# EAGLE schematic wrover-cam1 (EAGLE 9.6.2)
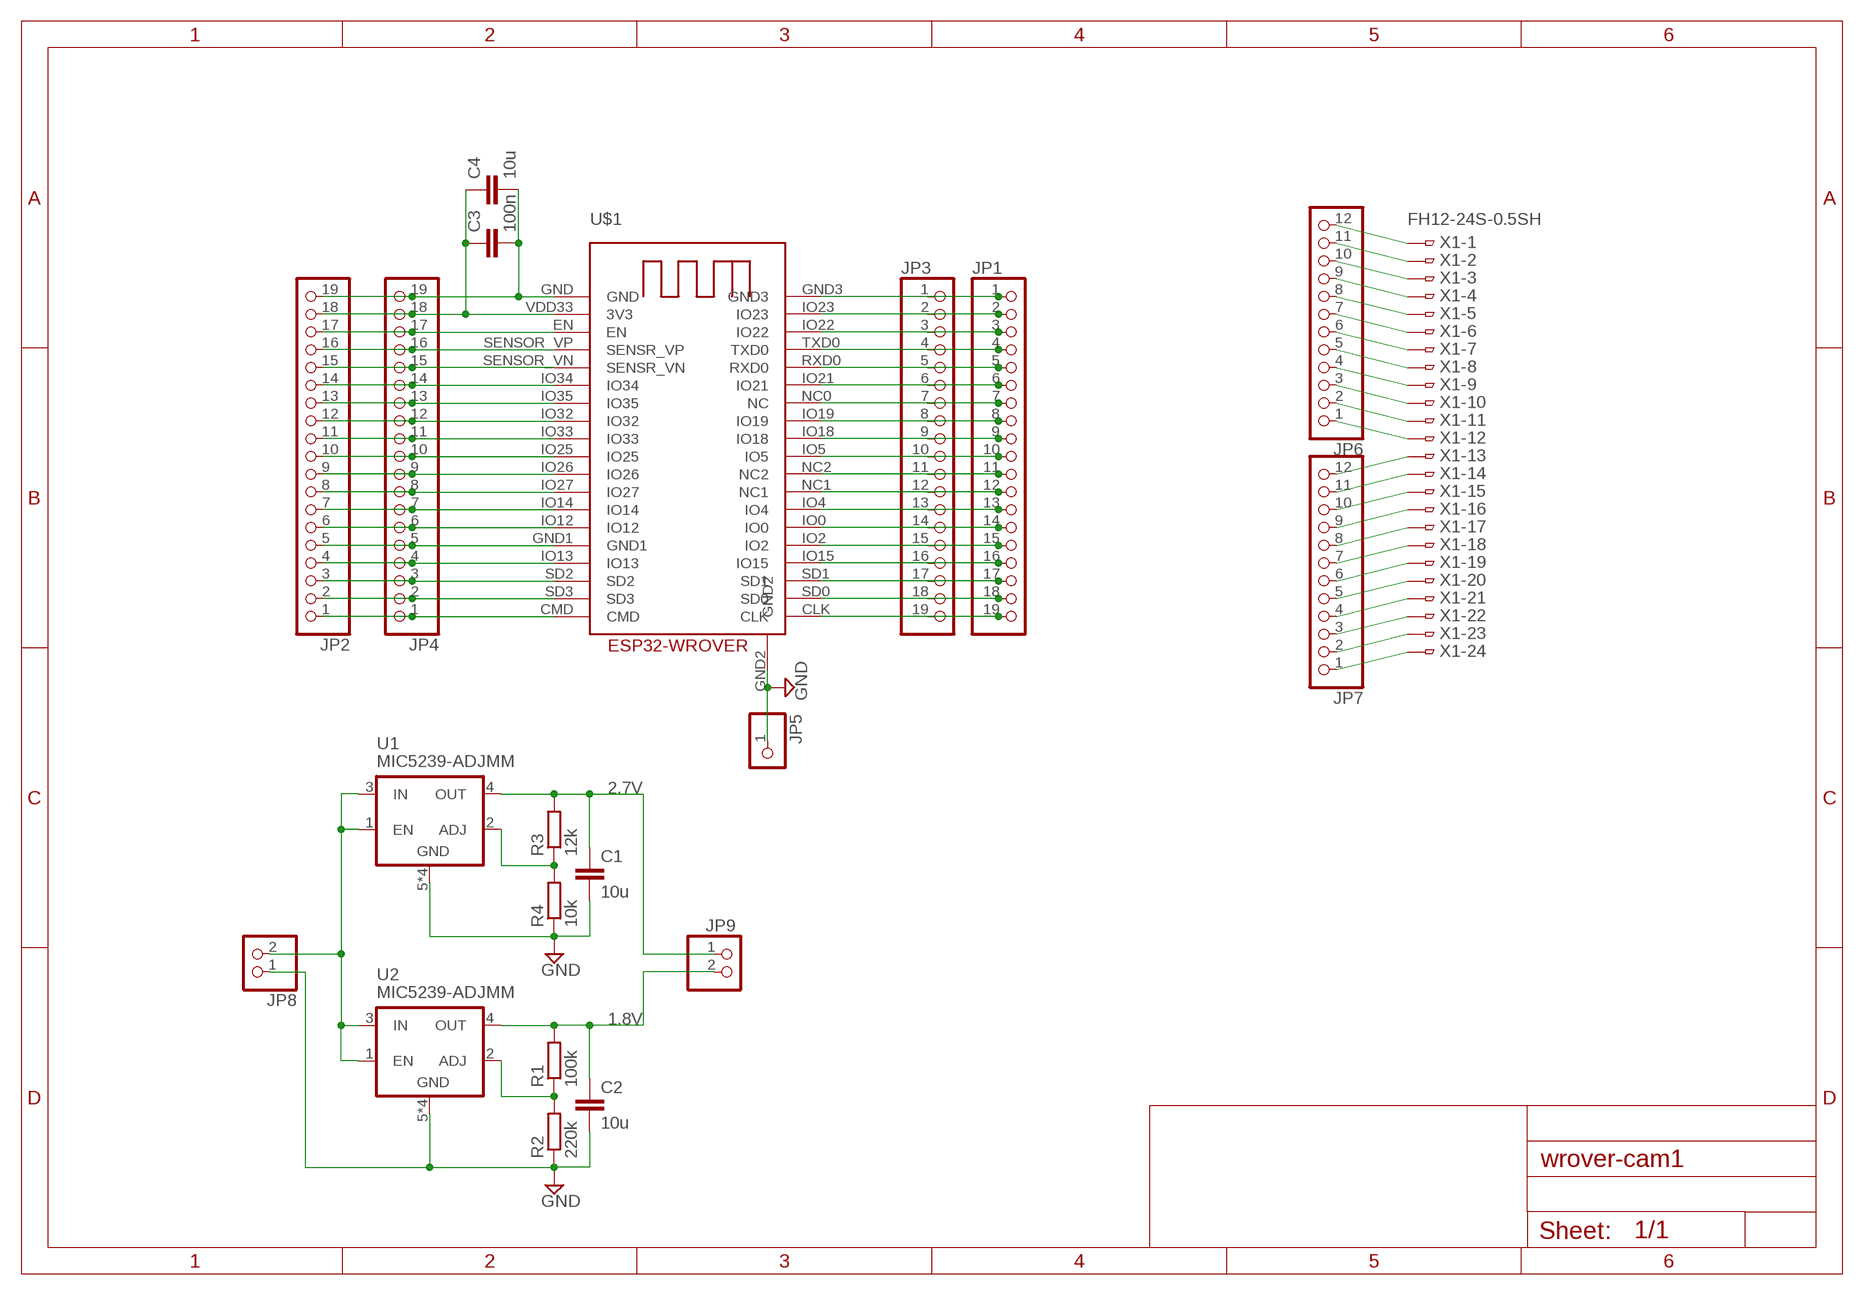
[diagram p0: schematic, sheet 1]

## Parts
C1  10u  C-EUC1210K  [C1210K]
C2  10u  C-EUC1210K  [C1210K]
C3  100n  C-EUC0805K  [C0805K]
C4  10u  C-EUC1210K  [C1210K]
JP1  PINHD-1X19  [1X19]
JP2  PINHD-1X19  [1X19]
JP3  PINHD-1X19  [1X19]
JP4  PINHD-1X19  [1X19]
JP5  PINHD-1X1  [1X01]
JP6  PINHD-1X12  [1X12]
JP7  PINHD-1X12  [1X12]
JP8  PINHD-1X2  [1X02]
JP9  PINHD-1X2  [1X02]
R1  100k  R-EU_R1206  [R1206]
R2  220k  R-EU_R1206  [R1206]
R3  12k  R-EU_R1206  [R1206]
R4  10k  R-EU_R1206  [R1206]
U1  MIC5239-ADJMM  [MSOP08]
U2  MIC5239-ADJMM  [MSOP08]
U$1  ESP32-WROVER  [ESP32-WROVER]
X1  FH12-24S-0.5SH  [FH12-24S-0.5SH]

## Nets
1.8V: C2.1 JP9.2 R1.2 U2.4(OUT)
2.7V: C1.1 JP9.1 R3.2 U1.4(OUT)
GND: C1.2 C2.2 JP5.1 JP8.1 R2.1 R4.1 U1.5(GND) U1.6(GND) U1.7(GND) U1.8(GND) U2.5(GND) U2.6(GND) U2.7(GND) U2.8(GND) U$1.GND2
N$1: JP2.10 JP4.10 U$1.IO25
N$2: JP2.1 JP4.1 U$1.CMD
N$3: JP2.2 JP4.2 U$1.SD3
N$4: JP2.3 JP4.3 U$1.SD2
N$5: JP2.4 JP4.4 U$1.IO13
N$6: JP2.5 JP4.5 U$1.GND1
N$7: JP2.6 JP4.6 U$1.IO12
N$8: JP2.7 JP4.7 U$1.IO14
N$9: JP2.8 JP4.8 U$1.IO27
N$10: JP2.9 JP4.9 U$1.IO26
N$11: JP2.11 JP4.11 U$1.IO33
N$12: JP2.12 JP4.12 U$1.IO32
N$13: JP2.13 JP4.13 U$1.IO35
N$14: JP2.14 JP4.14 U$1.IO34
N$15: JP2.16 JP4.16 U$1.SENSOR_VP(SENSR_VP)
N$16: JP2.17 JP4.17 U$1.EN
N$18: C3.2 C4.2 JP2.19 JP4.19 U$1.GND
N$19: JP1.1 JP3.1 U$1.GND3
N$20: JP1.2 JP3.2 U$1.IO23
N$21: JP1.3 JP3.3 U$1.IO22
N$22: JP1.4 JP3.4 U$1.TXD0
N$23: JP1.5 JP3.5 U$1.RXD0
N$24: JP1.6 JP3.6 U$1.IO21
N$25: JP1.7 JP3.7 U$1.NC0(NC)
N$26: JP1.8 JP3.8 U$1.IO19
N$27: JP1.9 JP3.9 U$1.IO18
N$28: JP1.10 JP3.10 U$1.IO5
N$29: JP1.11 JP3.11 U$1.NC2
N$30: JP1.12 JP3.12 U$1.NC1
N$31: JP1.13 JP3.13 U$1.IO4
N$32: JP1.14 JP3.14 U$1.IO0
N$33: JP1.15 JP3.15 U$1.IO2
N$34: JP1.16 JP3.16 U$1.IO15
N$35: JP1.17 JP3.17 U$1.SD1
N$36: JP1.18 JP3.18 U$1.SD0
N$37: JP1.19 JP3.19 U$1.CLK
N$38: JP2.15 JP4.15 U$1.SENSOR_VN(SENSR_VN)
N$40: JP6.12 X1.1
N$41: JP6.11 X1.2
N$42: JP6.10 X1.3
N$43: JP6.9 X1.4
N$44: JP6.8 X1.5
N$45: JP6.7 X1.6
N$46: JP6.6 X1.7
N$47: JP6.5 X1.8
N$48: JP6.4 X1.9
N$49: JP6.3 X1.10
N$50: JP6.2 X1.11
N$51: JP6.1 X1.12
N$52: JP7.12 X1.13
N$53: JP7.11 X1.14
N$54: JP7.10 X1.15
N$55: JP7.9 X1.16
N$56: JP7.8 X1.17
N$57: JP7.7 X1.18
N$58: JP7.6 X1.19
N$59: JP7.5 X1.20
N$60: JP7.4 X1.21
N$61: JP7.3 X1.22
N$62: JP7.2 X1.23
N$63: JP7.1 X1.24
N$91: R1.1 R2.2 U2.2(ADJ)
N$92: R3.1 R4.2 U1.2(ADJ)
N$93: C3.1 C4.1 JP2.18 JP4.18 U$1.VDD33(3V3)
N$95: JP8.2 U1.1(EN) U1.3(IN) U2.1(EN) U2.3(IN)

## Library data of the parts
C1-C4 = rcl:C-EU: CAPACITOR, European symbol; SPICEPREFIX: C
JP1-JP4 = pinhead:PINHD-1X19: PIN HEADER
JP5 = pinhead:PINHD-1X1: PIN HEADER
JP6 JP7 = pinhead:PINHD-1X12: PIN HEADER
JP8 JP9 = pinhead:PINHD-1X2: PIN HEADER
R1-R4 = rcl:R-EU_: RESISTOR, European symbol; SPICEPREFIX: R
U1 U2 = micrel:MIC5239-ADJ: LDO REGULATOR
U$1 = 32teeth - ESP32-WROVER:ESP32-WROVER
X1 = con-hirose:FH12-24S-0.5S: 0.5mm Pitch Connectors For FPC/FFC Source: Data sheet <http://www.hirose.co.jp/cataloge_hp/e58605370.pdf>; MPN: FH12-24S-0.5SH(55); OC_FARNELL: 1324552; OC_NEWARK: 34M6170